# Altium schematic sheet PSU.SchDoc
size A
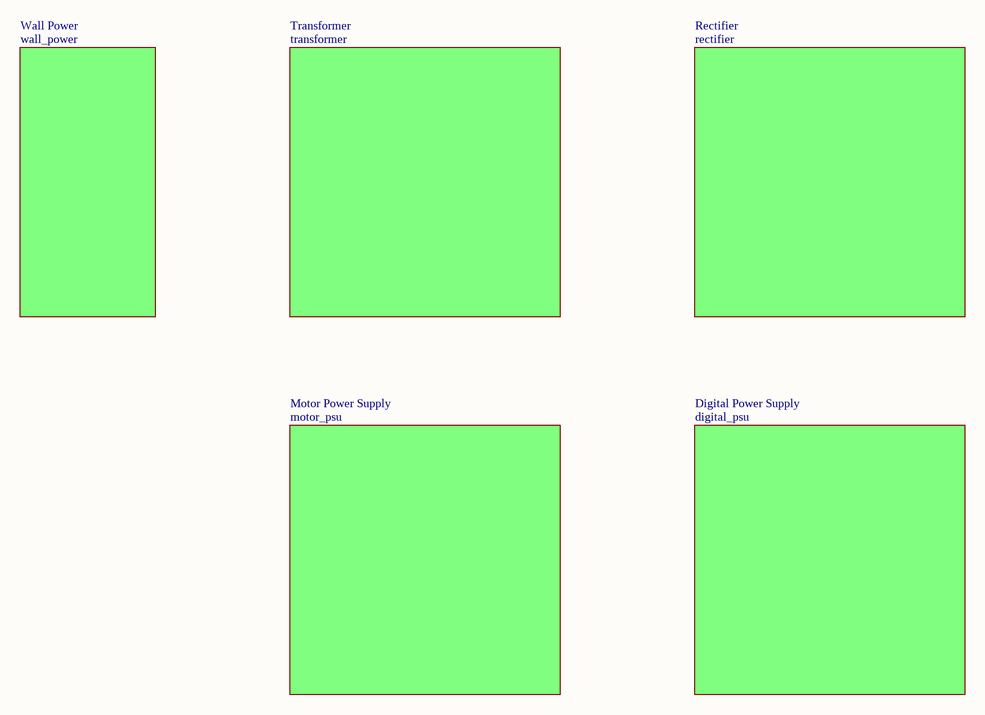
[diagram p0: PSU.SchDoc]

## Sub-sheets
Digital Power Supply = digital_psu: no entries
Motor Power Supply = motor_psu: no entries
Rectifier = rectifier: no entries
Transformer = transformer: no entries
Wall Power = wall_power: no entries